# Altium schematic sheet TRAY5.SchDoc
size A4
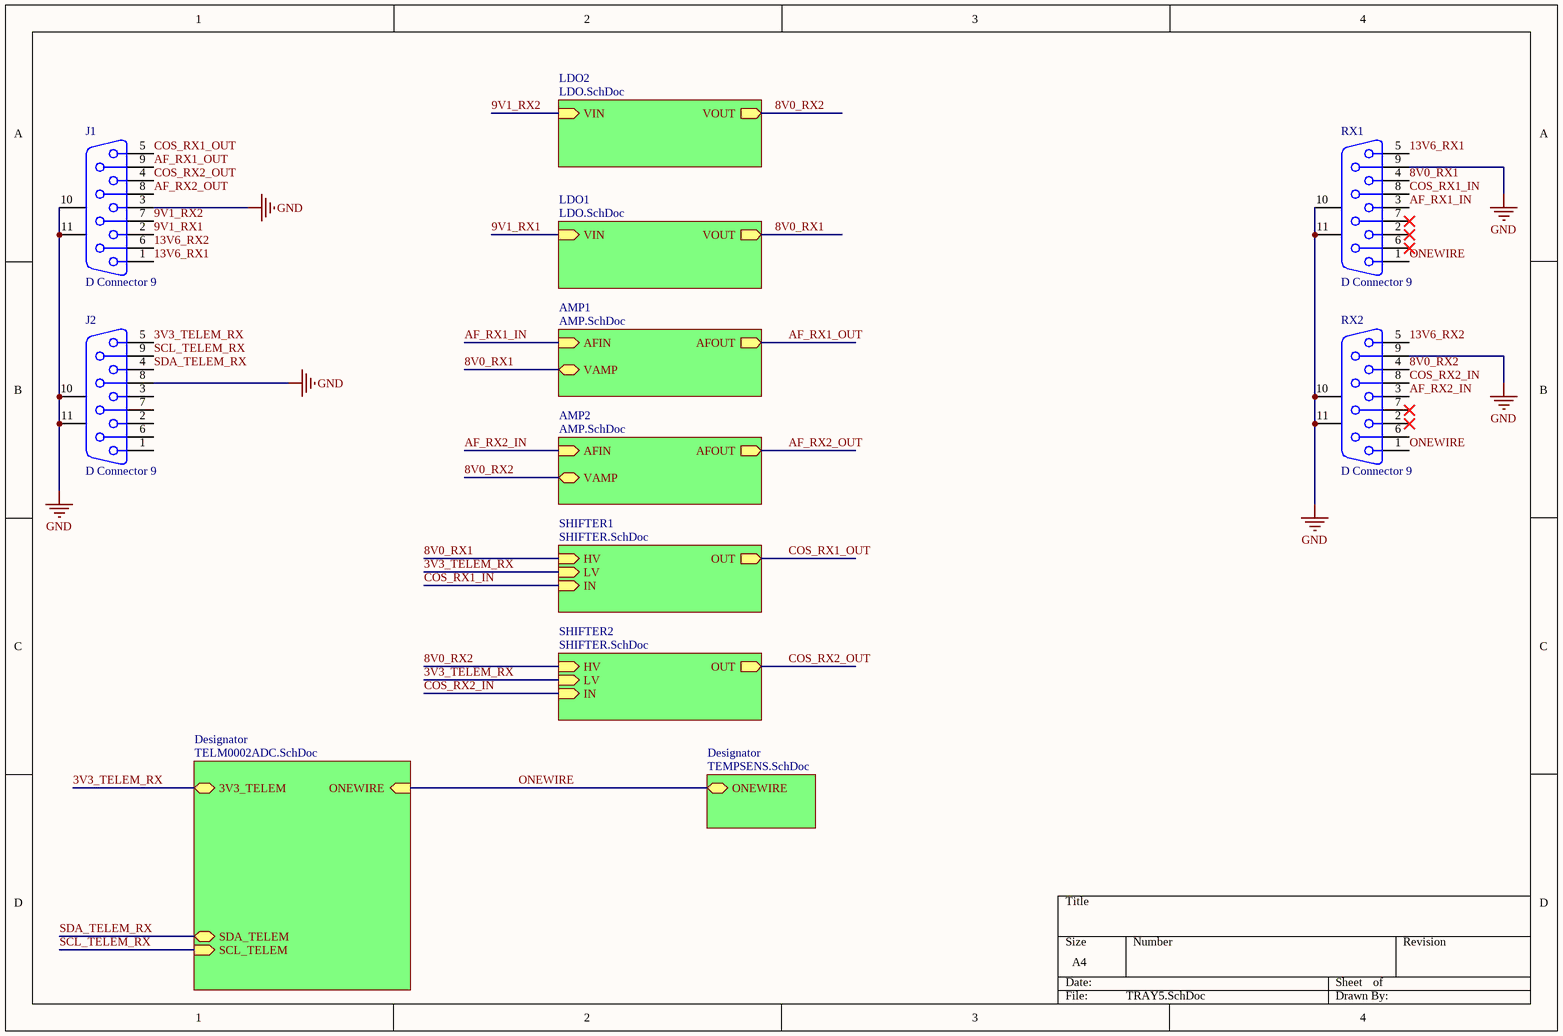
[diagram p0: TRAY5.SchDoc]

## Parts
J1  D Connector 9  [DSUB1.385-2H9]
J2  D Connector 9  [DSUB1.385-2H9]
RX1  D Connector 9  [DSUB Upright]
RX2  D Connector 9  [DSUB Upright]

## Sub-sheets
AMP1 = AMP.SchDoc: AFIN (in), AFOUT (out), VAMP
AMP2 = AMP.SchDoc: AFIN (in), AFOUT (out), VAMP
Designator = TELM0002ADC.SchDoc: SDA_TELEM (bidir), SCL_TELEM (in), ONEWIRE (in), 3V3_TELEM
Designator = TEMPSENS.SchDoc: ONEWIRE (bidir)
LDO1 = LDO.SchDoc: VOUT (out), VIN (in)
LDO2 = LDO.SchDoc: VOUT (out), VIN (in)
SHIFTER1 = SHIFTER.SchDoc: HV (in), LV (in), IN (in), OUT (out)
SHIFTER2 = SHIFTER.SchDoc: HV (in), LV (in), IN (in), OUT (out)

## Nets
GND: J1.3 J1.10(MH1) J1.11(MH2) J2.8 J2.10(MH1) J2.11(MH2) RX1.9 RX1.10(MH1) RX1.11(MH2) RX2.9 RX2.10(MH1) RX2.11(MH2)
3V3_TELEM_RX: J2.5 ; sheet Designator/3V3_TELEM, sheet SHIFTER1/LV, sheet SHIFTER2/LV
8V0_RX1: RX1.4 ; sheet LDO1/VOUT, sheet AMP1/VAMP, sheet SHIFTER1/HV
8V0_RX2: RX2.4 ; sheet LDO2/VOUT, sheet AMP2/VAMP, sheet SHIFTER2/HV
9V1_RX1: J1.2 ; sheet LDO1/VIN
9V1_RX2: J1.7 ; sheet LDO2/VIN
13V6_RX1: J1.1 RX1.5
13V6_RX2: J1.6 RX2.5
AF_RX1_IN: RX1.3 ; sheet AMP1/AFIN
AF_RX1_OUT: J1.9 ; sheet AMP1/AFOUT
AF_RX2_IN: RX2.3 ; sheet AMP2/AFIN
AF_RX2_OUT: J1.8 ; sheet AMP2/AFOUT
COS_RX1_IN: RX1.8 ; sheet SHIFTER1/IN
COS_RX1_OUT: J1.5 ; sheet SHIFTER1/OUT
COS_RX2_IN: RX2.8 ; sheet SHIFTER2/IN
COS_RX2_OUT: J1.4 ; sheet SHIFTER2/OUT
ONEWIRE: RX1.1 RX2.1 ; sheet Designator/ONEWIRE, sheet Designator/ONEWIRE
SCL_TELEM_RX: J2.9 ; sheet Designator/SCL_TELEM
SDA_TELEM_RX: J2.4 ; sheet Designator/SDA_TELEM

Not connected (* = marked no-connect by the designer): J2 1 2 3 6 7; RX1 2* 6* 7*; RX2 2* 6 7*

## Library data of the parts
J1 J2 = D Connector 9: Receptacle Assembly, 9 Position, Right Angle; Supplier: Digikey; Supplier P/N: A35109-ND
RX1 RX2 = D Connector 9: Receptacle Assembly, 9 Position, Upright; Supplier: Digikey; Supplier P/N: A34072-ND